# Altium schematic sheet OpenPLCv0.2.0_Watchdog.SchDoc
size 420 x 297 mm; PageSetup: Record=PageOptions|CenterHorizontal=True|CenterVertical=True|PrintScale=1.01|XCorrection=1.00|YCorrection=1.00|PrintKind=1|BorderSize=5000000|LeftOffset=0|BottomOffset=0|Orientation=2|PaperLength=1000|PaperWidth=1000|Scale=100|PaperSource=7|PrintQuality=-4|MediaType=1|DitherType=10|PaperKind=A3|PrintScaleMode=1; DocumentNumber: 20; SheetNumber: 20; SheetTotal: 22; SheetTitle: Watchdog Timer
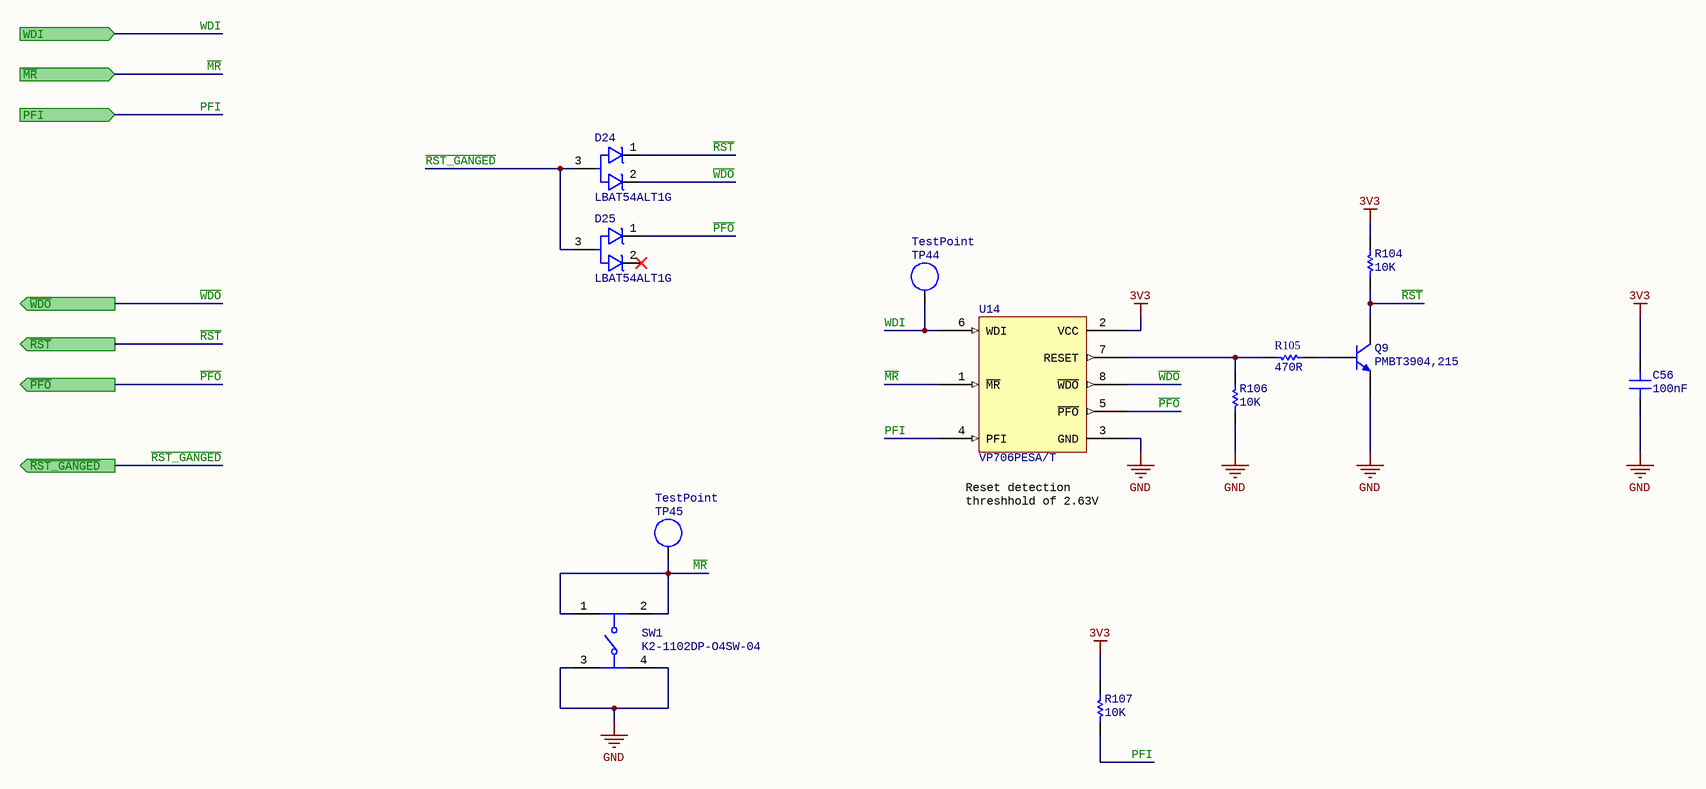
[diagram p0: OpenPLCv0.2.0_Watchdog.SchDoc]

## Parts
C56  Capacitance: 100nF  [SMD_CAP_0402(1005)_N]  (hidden comment: CC0402KRX5R6BB104)
D24  LBAT54ALT1G  [SOT23-3]
D25  LBAT54ALT1G  [SOT23-3]
Q9  PMBT3904,215  [SOT23-3]
R104  Resistance: 10K  [SMD_RES_0402(1005)_N]  (hidden comment: RC0402FR-0710KL)
R105  Resistance: 470R  [SMD_RES_0402(1005)_N]  (hidden comment: RC0402FR-07470RL)
R106  Resistance: 10K  [SMD_RES_0402(1005)_N]  (hidden comment: RC0402FR-0710KL)
R107  Resistance: 10K  [SMD_RES_0402(1005)_N]  (hidden comment: RC0402FR-0710KL)
SW1  K2-1102DP-O4SW-04  [K2-1102DP-O4SW-04]
TP44  TestPoint  [Pad]  (no BOM)
TP45  TestPoint  [Pad]  (no BOM)
U14  VP706PESA/T  [SOIC-8-3.9mm]

## Ports
PFI (in), WDI (in), ~{MR} (in), ~{PFO} (out), ~{RST_GANGED} (out), ~{RST} (out), ~{WDO} (out)

## Nets
3V3: C56.2 R104.2 R107.2 U14.2(VCC)
GND: C56.1 Q9.2(E) R106.1 SW1.3 SW1.4 U14.3(GND)
~{MR}: SW1.1 SW1.2 TP45.1 U14.1(~{MR}) ; port ~{MR}
~{PFO}: D25.1(CATHODE) U14.5(~{PFO}) ; port ~{PFO}
PFI: R107.1 U14.4(PFI) ; port PFI
~{RST}: D24.1(CATHODE) Q9.3(C) R104.1 ; port ~{RST}
~{RST_GANGED}: D24.3(ANODE) D25.3(ANODE) ; port ~{RST_GANGED}
~{WDO}: D24.2(CATHODE) U14.8(~{WDO}) ; port ~{WDO}
WDI: TP44.1 U14.6(WDI) ; port WDI
NetQ9_1: Q9.1(B) R105.2
NetR105_1: R105.1 R106.2 U14.7(RESET)

Not connected (* = marked no-connect by the designer): D25 2(CATHODE)*

## Notes on the sheet
- (near U14) Reset detection threshhold of 2.63V
- FILE NAME
- PROJECT
- TITLE
- REV
- AUTHOR
- SIZE
- SHEET
- DATE
- OF
- A3

## Library data of the parts
C56 = 100nF 0402 10V 10%: 100nF ±10% 10V X5R 0402 Multilayer Ceramic Capacitors MLCC - SMD/SMT RoHS; Package: 0402; Tolerance: 10%; Voltage Rating: 10V
D24 D25 = LBAT54ALT1G: 30V 200mA 320mV @ 1mA SOT-23(SOT-23-3) Schottky Barrier Diodes (SBD) RoHS
Q9 = PMBT3904,215: NPN 200mA 40V 250mW SOT-23(SOT-23-3) Transistors (NPN/PNP) RoHS
R104 R106 R107 = 10K 0402 1% 1/16W: 10kΩ ±1% 1/16W ±100ppm/℃ 0402 Chip Resistor - Surface Mount RoHS; Package: 0402; Tolerance: 1%; Power Rating: 1/16W
R105 = 470R 0402 1% 1W: 470Ω ±1% 1/16W ±100ppm/℃ 0402 Chip Resistor - Surface Mount RoHS; Power Rating: 1W; Package: 0402; Tolerance: 1%
SW1 = K2-1102DP-O4SW-04: 6x6x11mm Through Hole Tactile Switches ROHS
TP44 TP45 = Test point
U14 = VP706PESA/T: SIOC-8 Monitors & Reset Circuits ROHS, 2.63V, -40°C to 85°C (copy of MAX706P)